# EAGLE design MotorControl-v1 (EAGLE 6.3)
DATE: 2015
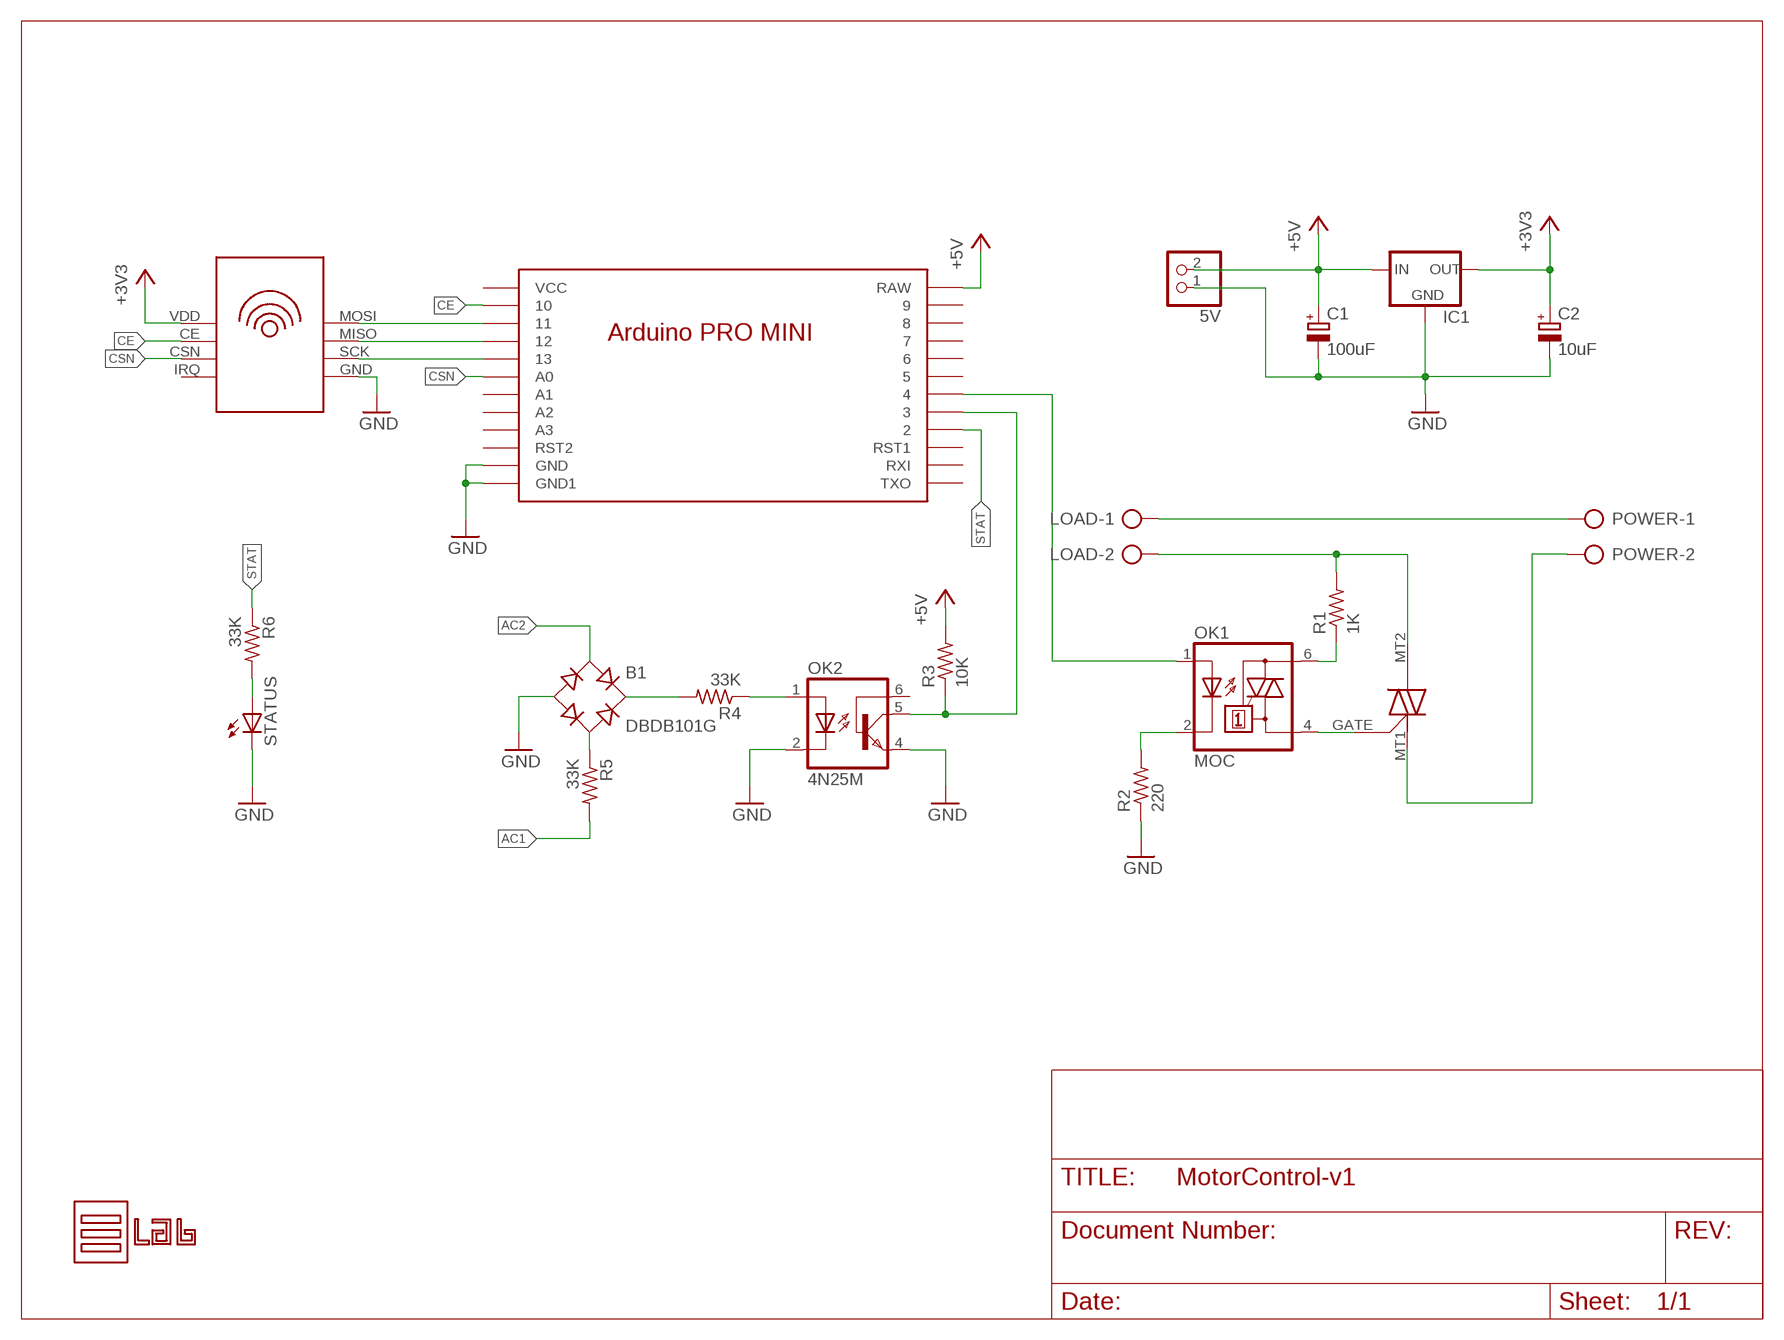
[diagram p0: schematic, sheet 1]

## Parts
5V  PINHD-1X2  [1X02]
B1  DBDB101G  [DB]
C1  100uF  CPOL-EUE2-5  [E2-5]
C2  10uF  CPOL-EUE2-5  [E2-5]
IC1  78LXX  [78LXX]
J1  MAC12  [MAC12]
LOAD  AK300/2  [AK300/2]
OK1  MOC  MOC3041M  [DIL06]
OK2  4N25M  [DIL06]
POWER  AK300/2  [AK300/2]
R1  1K  R-US_0204/7  [0204/7]
R2  220  R-US_0204/7  [0204/7]
R3  10K  R-US_0204/7  [0204/7]
R4  33K  R-US_0204/7  [0204/7]
R5  33K  R-US_0204/7  [0204/7]
R6  33K  R-US_0204/7  [0204/7]
STATUS  LED3MM  [LED3MM]
U$1  NANO  [NANO]
U$2  NRF24L01  [NRF24L01]
U$3  LOGO  [LOGO]

## Nets
+3V3: C2.+ IC1.OUT U$2.VDD
+5V: 5V.2 C1.+ IC1.IN R3.2 U$1.RAW
AC1: J1.MT1 POWER.2 R5.2
AC2: B1.AC1 LOAD.1 POWER.1
CE: U$1.10 U$2.CE
CSN: U$1.A0 U$2.CSN
GND: 5V.1 B1.- C1.- C2.- IC1.GND OK2.2(C) OK2.4(EMI) R2.1 STATUS.K(C) U$1.GND1(GND) U$1.GND2(GND1) U$2.GND
N$1: J1.GATE OK1.4(A1)
N$2: B1.AC2 R5.1
N$3: OK1.1(A) U$1.4
N$4: U$1.13 U$2.SCK
N$5: OK1.2(C) R2.2
N$6: OK1.6(A2) R1.1
N$7: OK2.5(COL) R3.1 U$1.3
N$8: B1.+ R4.2
N$9: OK2.1(A) R4.1
N$10: U$1.12 U$2.MISO
N$11: J1.MT2 LOAD.2 R1.2
N$12: U$1.11 U$2.MOSI
N$13: R6.2 STATUS.A
STAT: R6.1 U$1.2
Unconnected: OK2.6(BAS) U$1.5 U$1.6 U$1.7 U$1.8 U$1.9 U$1.A1 U$1.A2 U$1.A3 U$1.RST1 U$1.RST2 U$1.RXI U$1.TXO U$1.VCC U$2.IRQ

## Library data of the parts
5V = pinhead:PINHD-1X2: PIN HEADER
B1 = rectifier:DB?*G: Single Phase 1.0 AMP Glass Passivated Bridge Rectifier Taiwan Semiconductor Co.,Ltd. - TSC Source: http://www.taiwansemi.com/TSCbig5/ezcatfiles/cust/img/img/db101g.pdf http://www.ts.com.tw/db/pictures/modules/PDT/PDT060207001/DBLS201G.pdf
C1 C2 = resistor:CPOL-EU: POLARIZED CAPACITOR, European symbol
IC1 = v-reg:78LXX: VOLTAGE REGULATOR
J1 = E-Lab:MAC12
LOAD POWER = con-ptr500:AK300/2: CONNECTOR; OC_FARNELL: unknown; OC_NEWARK: unknown
OK1 = optocoupler:MOC30*: 6-Pin DIP Zero-Cross Optoisolators Triac Driver Output (250/400 Volt Peak) Source: http://www.fairchildsemi.com/ds/MO/MOC3043-M.pdf; MF: FAIRCHILD SEMICONDUCTOR; MPN: MOC3041M; OC_FARNELL: 1086677; OC_NEWARK: 78K6090
OK2 = optocoupler:4N*?M: General Purpose 6-Pin Phototransistor Optocouplers Source: http://www.fairchildsemi.com/ds/4N/4N35-M.pdf; MPN: 4N25-M; OC_FARNELL: 1021349; OC_NEWARK: 98K9084
R1-R6 = resistor:R-US_: RESISTOR, American symbol
STATUS = led:LED: LED OSRAM: - CHIPLED LG R971, LG N971, LY N971, LG Q971, LY Q971, LO R971, LY R971 LH N974, LH R974 LS Q976, LO Q976, LY Q976 LO Q996 - Hyper CHIPLED LW Q18S LB Q993, LB Q99A, LB R99A - SideLED LS A670, LO A670, LY A670, LG A670, LP A670 LB A673, LV A673, LT A673, LW A673 LH A674 LY A675 LS A676, LA A676, LO A676, LY A676, LW A676 LS A679, LY A679, LG A679 - Hyper Micro SIDELED® LS Y876, LA Y876, LO Y876, LY Y876 LT Y87S - SmartLED LW L88C, LW L88S LB L89C, LB L89S, LG L890 LS L89K, LO L89K, LY L89K LS L896, LA L896, LO L896, LY L896 - TOPLED LS T670, LO T670, LY T670, LG T670, LP T670 LSG T670, LSP T670, LSY T670, LOP T670, LYG T670 LG T671, LOG T671, LSG T671 LB T673, LV T673, LT T673, LW T673 LH T674 LS T676, LA T676, LO T676, LY T676, LB T676, LH T676, LSB T676, LW T676 LB T67C, LV T67C, LT T67C, LS T67K, LO T67K, LY T67K, LW E67C LS E67B, LA E67B, LO E67B, LY E67B, LB E67C, LV E67C, LT E67C LW T67C LS T679, LY T679, LG T679 LS T770, LO T770, LY T770, LG T770, LP T770 LB T773, LV T773, LT T773, LW T773 LH T774 LS E675, LA E675, LY E675, LS T675 LS T776, LA T776, LO T776, LY T776, LB T776 LHGB T686 LT T68C, LB T68C - Hyper Mini TOPLED® LB M676 - Mini TOPLED Santana® LG M470 LS M47K, LO M47K, LY M47K Source: http://www.osram.convergy.de LUXEON: - LUMILED® LXK2-PW12-R00, LXK2-PW12-S00, LXK2-PW14-U00, LXK2-PW14-V00 LXK2-PM12-R00, LXK2-PM12-S00, LXK2-PM14-U00 LXK2-PE12-Q00, LXK2-PE12-R00, LXK2-PE12-S00, LXK2-PE14-T00, LXK2-PE14-U00 LXK2-PB12-K00, LXK2-PB12-L00, LXK2-PB12-M00, LXK2-PB14-N00, LXK2-PB14-P00, LXK2-PB14-Q00 LXK2-PR12-L00, LXK2-PR12-M00, LXK2-PR14-Q00, LXK2-PR14-R00 LXK2-PD12-Q00, LXK2-PD12-R00, LXK2-PD12-S00 LXK2-PH12-R00, LXK2-PH12-S00 LXK2-PL12-P00, LXK2-PL12-Q00, LXK2-PL12-R00 Source: www.luxeon.com KINGBRIGHT: KA-3528ASYC Source: www.kingbright.com
U$1 = E-Lab:NANO
U$2 = E-Lab:NRF24L01
U$3 = E-Lab:LOGO: E-Lab Logo Logo diseñado para el proyecto Electronic's Lab

## Board
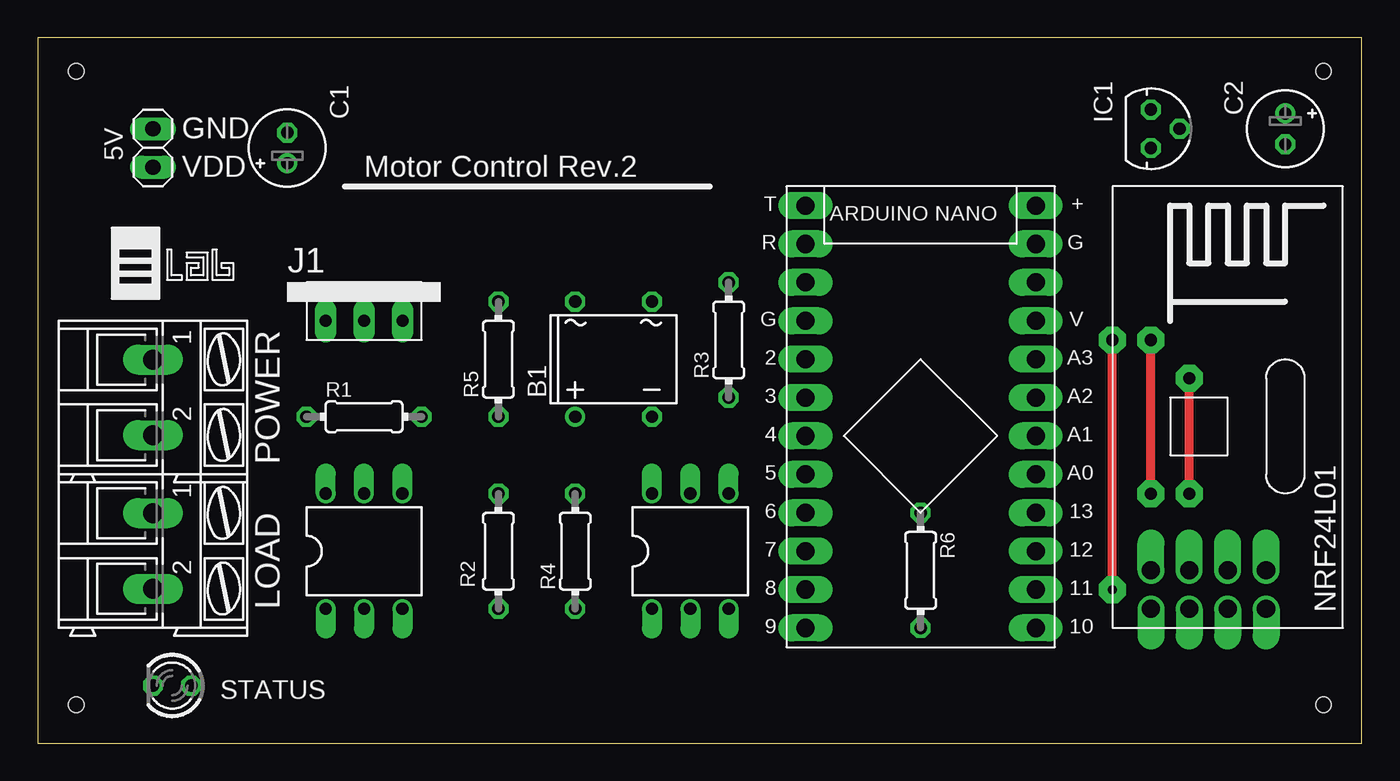
[diagram p1: board, top side]
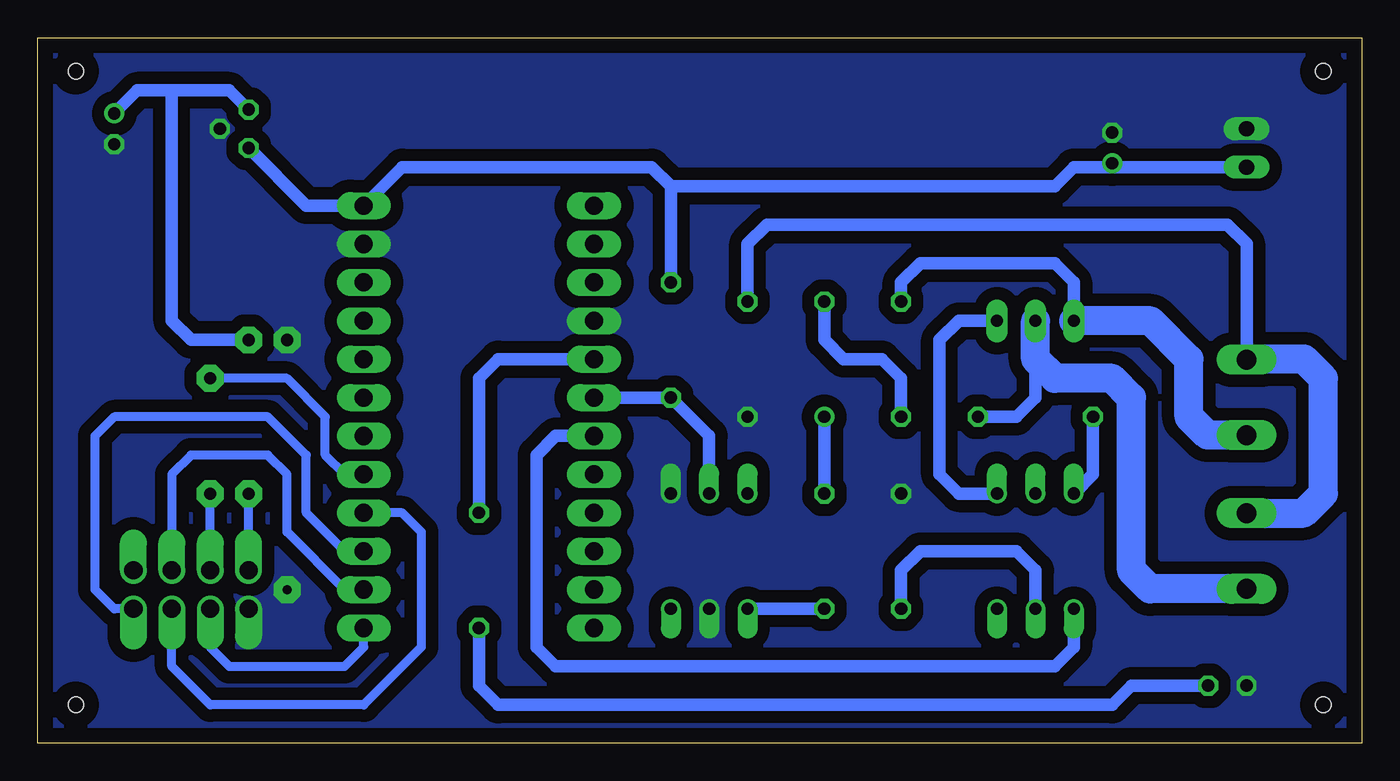
[diagram p2: board, bottom side, seen from below]

Size 87.61 x 46.66 mm. Coordinates in mm from the lower left corner, seen from the top.
Outline: 0,0 87.61,0 87.61,46.66 0,46.66 0,0
Copper layers (1*16): Top 0.035mm / dielectric 1.5mm / Bottom 0.035mm
Design rules "default": minimum track width 10mil, minimum drill 24mil, track to track 8mil, track to pad 8mil, pad to pad 8mil, via to via 8mil, smd to smd 8mil, copper to edge 40mil, drill to drill 8mil, minimum pad ring 10mil, minimum via ring 8mil, stop-mask expansion 4mil, vias tented up to drill 0mil, thermal gap 10mil
Holes 1 mm at 2.54,44.45 2.54,2.54 85.09,2.54 85.09,44.45

### Footprints (pad centres in the part's own frame; a part is rotated, then mirrored left to right if it is on the bottom)
1X02 = drill 1.016 long: 1 -1.27,0; 2 1.27,0
DB = drill 0.813: + -2.54,-3.81 | drill 0.813 octagon: - 2.54,-3.81; AC1 2.54,3.81; AC2 -2.54,3.81
E2-5 = drill 0.813 pad 1.27: + -1.016,0 | drill 0.813 pad 1.27 octagon: - 1.016,0
78LXX = drill 0.813 octagon: GND 0,1.905; IN 1.27,0; OUT -1.27,0
MAC12 = drill 0.8 pad 1.422 long: GATE 2.54,0; MT1 -2.54,0; MT2 0,0
AK300/2 = drill 1.321 long: 1 -2.515,0; 2 2.489,0
DIL06 = drill 0.813 offset: 1 -2.54,-3.81; 2 0,-3.81; 3 2.54,-3.81; 4 2.54,3.81; 5 0,3.81; 6 -2.54,3.81
0204/7 = drill 0.813 octagon: 1 -3.81,0; 2 3.81,0
LED3MM = drill 0.813 octagon: A -1.27,0; K 1.27,0
NANO = drill 1.2 long: 2 7.62,-5.08; 3 7.62,-2.54; 4 7.62,0; 5 7.62,2.54; 6 7.62,5.08; 7 7.62,7.62; 8 7.62,10.16; 9 7.62,12.7; 10 -7.62,12.7; 11 -7.62,10.16; 12 -7.62,7.62; 13 -7.62,5.08; A0 -7.62,2.54; A1 -7.62,0; A2 -7.62,-2.54; A3 -7.62,-5.08; GND1 -7.62,-12.7; GND2 7.62,-7.62; RAW -7.62,-15.24; RST1 -7.62,-10.16; RST2 7.62,-10.16; RXI 7.62,-12.7; TXO 7.62,-15.24; VCC -7.62,-7.62
NRF24L01 = drill 1.2 offset: CE 1.27,-2.54; CSN -1.27,-2.54; GND 1.27,-5.08; IRQ -1.27,2.54; MISO 1.27,2.54; MOSI -1.27,0; SCK 1.27,0; VDD -1.27,-5.08

### Placement (x,y rotation side)
5V  7.62,39.37 270 top
B1  38.1,25.4 0 top
C1  16.51,39.37 90 top
C2  82.55,40.64 270 top
IC1  73.66,40.64 270 top
J1  21.59,27.94 0 top
LOAD  7.62,12.7 270 top
OK1  21.59,12.7 0 top
OK2  43.18,12.7 0 top
POWER  7.62,22.86 270 top
R1  21.59,21.59 0 top
R2  30.48,12.7 270 top
R3  45.72,26.67 90 top
R4  35.56,12.7 90 top
R5  30.48,25.4 90 top
R6  58.42,11.43 270 top
STATUS  8.89,3.81 180 top
U$1  58.42,20.32 180 top
U$2  78.74,10.16 270 top
U$3  6.35,31.75 0 top

### Tracks (layer width: path | path; a pad name or v marks a point on that pad's centre or on a via)
+3V3  (via drill 0.8 pad 1.78)
  Top 0.61: v73.66,16.51 v73.66,26.67
  Bottom 0.61: U$2.VDD v73.66,16.51
  Bottom 0.813: 82.3,41.66 C2.+ 81.03,43.18 78.74,43.18 | IC1.OUT 74.93,43.18 78.74,43.18 | v73.66,26.67 77.47,26.67 78.74,27.94 78.74,43.18
+5V
  Bottom 0.813: 45.72,36.83 46.99,38.1 63.5,38.1 U$1.RAW 69.85,35.56 IC1.IN | 45.72,36.83 R3.2 | 5V.2 16.26,38.1 C1.+ 16.51,38.1 19.05,38.1 20.32,36.83 45.72,36.83
AC1
  Bottom 0.813: R5.2 30.48,30.48 29.21,31.75 20.32,31.75 19.05,30.48 J1.MT1
  Bottom 1.93: POWER.2 10.21,20.37 11.43,21.59 11.43,25.4 13.97,27.94 J1.MT1
AC2
  Bottom 0.813: 6.33,25.4 POWER.1 7.62,33.02 8.89,34.29 39.37,34.29 40.64,33.02 B1.AC1
  Bottom 1.93: LOAD.1 3.83,15.21 2.54,16.51 2.54,24.13 3.81,25.4 6.33,25.4
CE
  Bottom 0.61: U$2.CE 76.2,6.35 74.93,5.08 67.31,5.08 66.04,6.35 U$1.10
CSN  (via drill 0.8 pad 1.78)
  Top 0.61: v76.2,16.51 v76.2,24.13
  Bottom 0.61: U$1.A0 67.31,17.78 68.58,19.05 68.58,21.59 71.12,24.13 v76.2,24.13 | U$2.CSN v76.2,16.51
GND  (via drill 0.6 pad 1.78, 0.8 pad 1.78)
  Top 0.61: v71.12,10.16 v71.12,26.67
  pour Bottom (isolate 0.813, no thermals): 0,0 0,46.99 87.63,46.99 87.63,0
N$1
  Bottom 0.813: OK1.4 26.67,16.51 27.94,17.78 27.94,26.67 26.67,27.94 J1.GATE
N$2
  Bottom 0.813: R5.1 30.48,24.13 31.75,25.4 34.29,25.4 35.56,26.67 B1.AC2
N$3
  Bottom 0.813: OK1.1 19.05,6.35 20.32,5.08 53.34,5.08 54.61,6.35 54.61,19.05 53.34,20.32 U$1.4
N$4
  Bottom 0.61: U$1.13 63.5,15.24 62.23,13.97 62.23,6.35 66.04,2.54 76.2,2.54 78.74,5.08 U$2.SCK
N$5
  Bottom 0.813: OK1.2 21.59,11.43 22.86,12.7 29.21,12.7 30.48,11.43 R2.2
N$6
  Bottom 0.813: OK1.6 17.78,17.78 R1.1
N$7
  Bottom 0.813: OK2.5 43.18,20.32 R3.1 U$1.3
N$8
  Bottom 0.813: B1.+ R4.2
N$9
  Bottom 0.813: R4.1 OK2.1
N$10
  Bottom 0.61: U$2.MISO 82.55,8.89 83.82,10.16 83.82,20.32 82.55,21.59 72.39,21.59 69.85,19.05 69.85,15.24 67.31,12.7 U$1.12
N$11
  Bottom 0.813: R1.2 22.86,21.59 21.59,22.86 J1.MT2
  Bottom 1.93: LOAD.2 14.02,10.21 15.24,11.43 15.24,22.86 16.51,24.13 20.32,24.13 21.59,25.4 J1.MT2
N$12
  Bottom 0.61: U$1.11 67.31,10.16 71.12,13.97 71.12,17.78 72.39,19.05 77.47,19.05 78.74,17.78 U$2.MOSI
N$13
  Bottom 0.813: STATUS.A 15.24,3.81 16.51,2.54 57.15,2.54 58.42,3.81 R6.2
STAT
  Bottom 0.813: R6.1 58.42,24.13 57.15,25.4 U$1.2

### Text on the board
tPlace: GND | VDD | Motor Control Rev.2